# EAGLE design Sound Sensor (EAGLE 5.11)
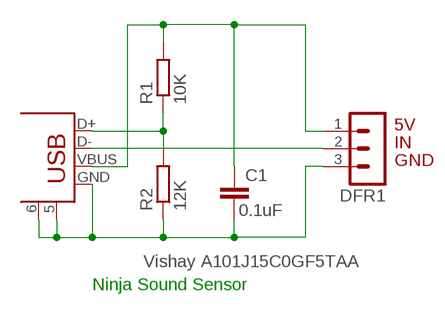
[diagram p0: schematic, sheet 1]

## Parts
C1  0.1uF  C-EU102-043X133  [C102-043X133]
DFR1  MA03-1  [MA03-1]
R1  10K  R-EU_0207/10  [0207/10]
R2  12K  R-EU_0207/10  [0207/10]
U$1  USB_A_FEMALE  [USB_A_FEMALE_PTH]

## Nets
GND: C1.2 DFR1.3 R2.1 U$1.5(GND) U$1.6(GND) U$1.GND
N$1: R1.1 R2.2 U$1.D+
N$2: C1.1 DFR1.1 R1.2 U$1.VBUS
N$4: DFR1.2 U$1.D-

## Notes on the sheet
- 5V
- IN
- GND
- Vishay A101J15C0GF5TAA
- Ninja Sound Sensor

## Library data of the parts
C1 = resistor:C-EU: CAPACITOR, European symbol
DFR1 = con-lstb:MA03-1: PIN HEADER; OC_FARNELL: unknown; OC_NEWARK: unknown
R1 R2 = resistor:R-EU_: RESISTOR, European symbol
U$1 = ninja:USB_A_FEMALE: USB_A_PTH is MULTICOMP - MC32593 - Connector Type:USB 2.0 A <http://au.element14.com/multicomp/mc32593/connector-type-usb-2-0-a/dp/1696534>

## Board
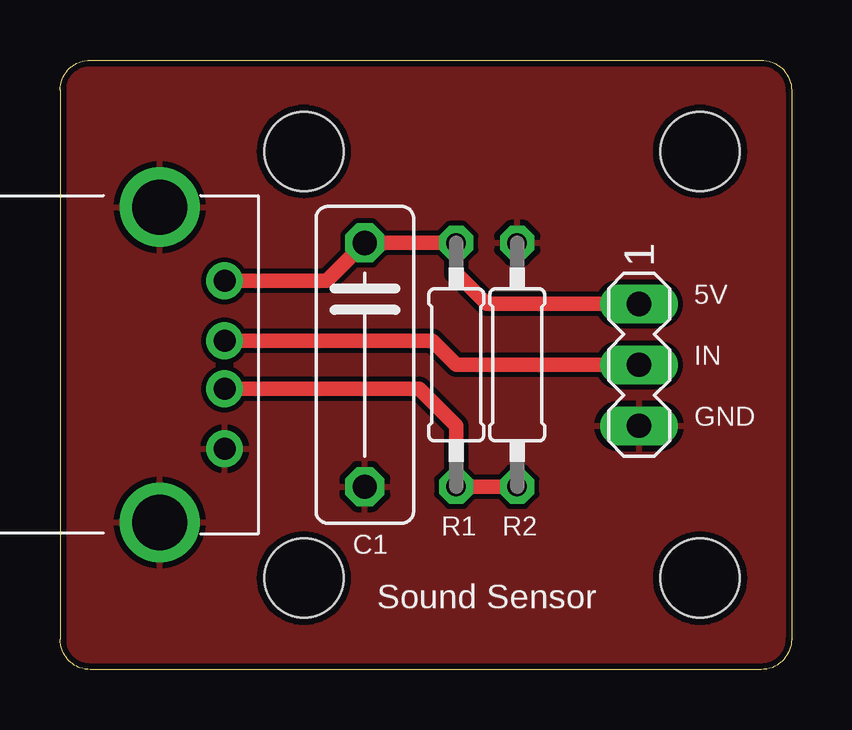
[diagram p1: board, top side]
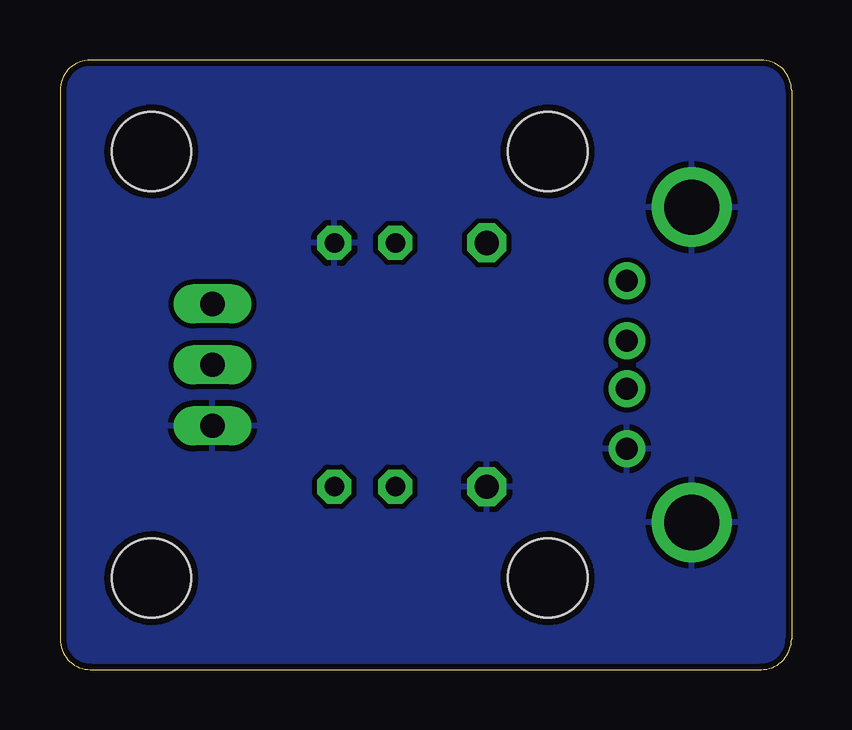
[diagram p2: board, bottom side, seen from below]

Size 30.48 x 25.4 mm. Coordinates in mm from the lower left corner, seen from the top.
Outline: 0,24.13 0,1.27 arc90 1.27,0 29.21,0 arc90 30.48,1.27 30.48,24.13 arc90 29.21,25.4 1.27,25.4 arc90 0,24.13
Copper layers (1*16): Top 0.035mm / dielectric 1.5mm / Bottom 0.035mm
Design rules "SparkFun": minimum track width 8mil, minimum drill 20mil, track to track 8mil, track to pad 8mil, pad to pad 8mil, via to via 8mil, smd to smd 8mil, copper to edge 10mil, drill to drill 8mil, minimum pad ring 12mil, minimum via ring 10mil, stop-mask expansion 4mil, vias tented up to drill 25mil, thermal gap 10mil

### Footprints (pad centres in the part's own frame; a part is rotated, then mirrored left to right if it is on the bottom)
C102-043X133 = drill 1.016 octagon: 1 -5.08,0; 2 5.08,0
MA03-1 = drill 1.016 long: 1 -2.54,0; 2 0,0; 3 2.54,0
0207/10 = drill 0.813 octagon: 1 -5.08,0; 2 5.08,0
USB_A_FEMALE_PTH = drill 2.3 round: 5 -6.57,-2.7; 6 6.57,-2.7 | drill 0.92 round: D+ 1,0; D- -1,0; GND 3.5,0; VBUS -3.5,0
STAND-OFF = hole 3.302: 0,0

### Placement (x,y rotation side)
C1  12.7,12.7 270 top
DFR1  24.13,12.7 270 top
R1  16.51,12.7 90 top
R2  19.05,12.7 270 top
U$1  6.86,12.7 270 top
U$2  [STAND-OFF]  26.67,21.59 0 top
U$3  [STAND-OFF]  26.67,3.81 0 top
U$4  [STAND-OFF]  10.16,3.81 0 top
U$5  [STAND-OFF]  10.16,21.59 0 top

### Tracks (layer width: path | path; a pad name or v marks a point on that pad's centre or on a via)
GND
  pour Top: -2.54,27.94 -2.54,-2.54 33.02,-2.54 33.02,27.94
  pour Bottom: -2.54,27.94 33.02,27.94 33.02,25.4 33.02,-2.54 -2.54,-2.54
N$1
  Top 0.61: R2.2 R1.1 16.51,10.16 14.97,11.7 U$1.D+
N$2
  Top 0.61: DFR1.1 17.78,15.24 16.51,16.51 R1.2 C1.1 11.12,16.2 U$1.VBUS
N$4
  Top 0.61: U$1.D- 15.51,13.7 16.51,12.7 DFR1.2

### Text on the board
tPlace: 5V | IN | GND | Sound Sensor